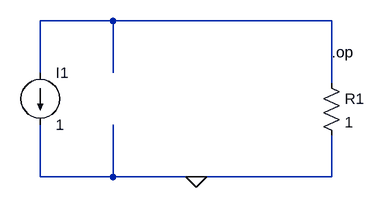
[diagram p0: schematic CSource_R.asc]
CSource_R.asc, the LTspice schematic file:
Version 4
SHEET 1 880 680
WIRE 192 192 80 192
WIRE 528 192 192 192
WIRE 80 272 80 192
WIRE 192 272 192 192
WIRE 528 288 528 192
WIRE 80 432 80 352
WIRE 192 432 192 352
WIRE 192 432 80 432
WIRE 320 432 192 432
WIRE 528 432 528 368
WIRE 528 432 320 432
FLAG 320 432 0
SYMBOL current 80 272 R0
SYMATTR InstName I1
SYMATTR Value 1
SYMBOL res 512 272 R0
SYMATTR InstName R1
SYMATTR Value 1
TEXT 528 240 Left 2 !.op

The netlist it stands for:
* CSource_R.asc
I1 N001 0 1
R1 N001 0 1
.op
.backanno
.end